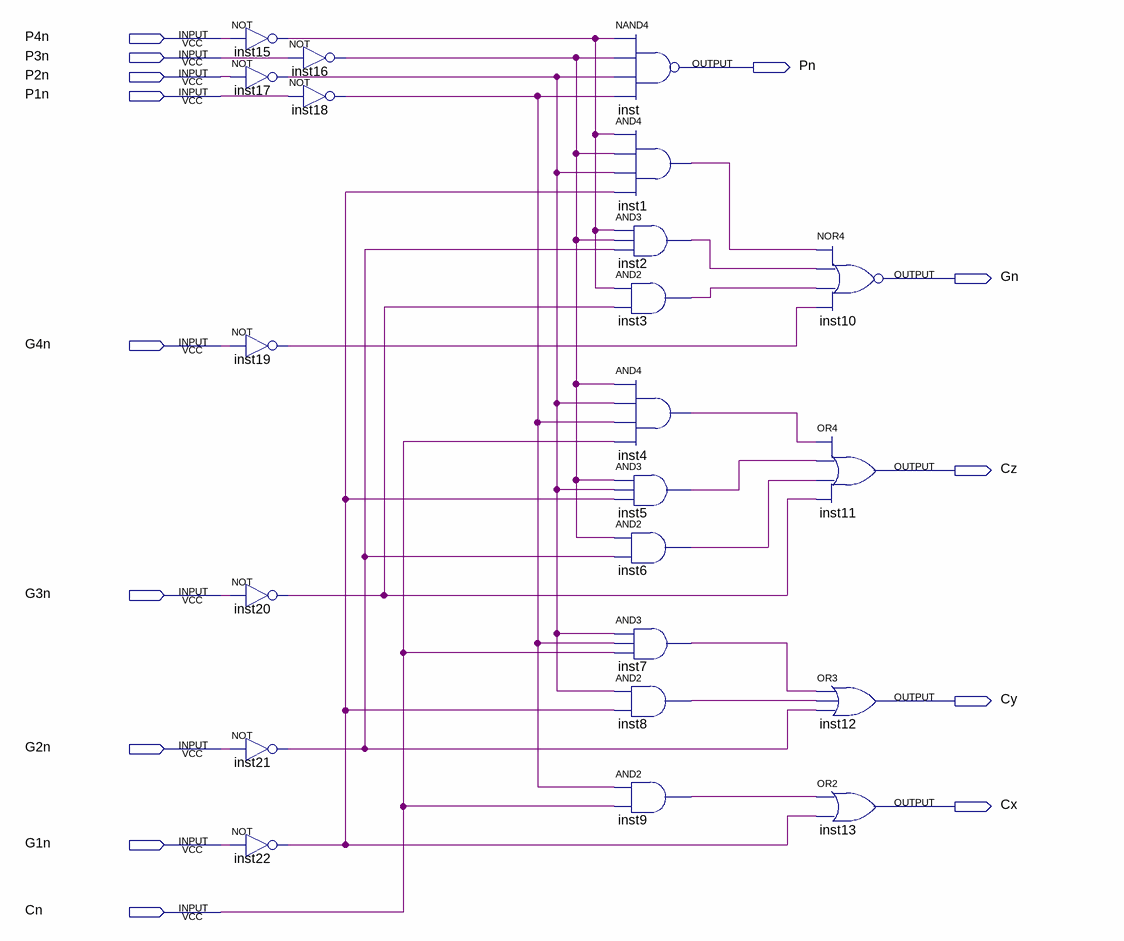
[diagram p0: schematic sheet]
// Quartus schematic ALUIP4.bdf as structural Verilog: 22 symbols, 14 pins
module ALUIP4 (
  input  P4n,
  input  P3n,
  input  P2n,
  input  P1n,
  input  G4n,
  input  G3n,
  input  G2n,
  input  G1n,
  input  Cn,
  output Pn,
  output Gn,
  output Cz,
  output Cy,
  output Cx
);

  wire inst1_out, inst2_out, inst3_out, inst4_out, inst5_out, inst6_out, inst7_out, inst8_out, inst9_out,
       inst15_out, inst16_out, inst17_out, inst18_out, inst19_out, inst20_out, inst21_out, inst22_out;

  not inst15 (inst15_out, P4n);
  not inst16 (inst16_out, P3n);
  not inst17 (inst17_out, P2n);
  not inst18 (inst18_out, P1n);
  not inst19 (inst19_out, G4n);
  not inst20 (inst20_out, G3n);
  not inst21 (inst21_out, G2n);
  not inst22 (inst22_out, G1n);
  nand inst (Pn, inst15_out, inst16_out, inst17_out, inst18_out);
  and inst1 (inst1_out, inst15_out, inst16_out, inst17_out, inst22_out);
  and inst2 (inst2_out, inst15_out, inst16_out, inst21_out);
  and inst3 (inst3_out, inst15_out, inst20_out);
  and inst4 (inst4_out, inst16_out, inst17_out, inst18_out, Cn);
  and inst5 (inst5_out, inst16_out, inst17_out, inst22_out);
  and inst6 (inst6_out, inst16_out, inst21_out);
  and inst7 (inst7_out, inst17_out, inst18_out, Cn);
  and inst8 (inst8_out, inst17_out, inst22_out);
  and inst9 (inst9_out, inst18_out, Cn);
  nor inst10 (Gn, inst1_out, inst2_out, inst3_out, inst19_out);
  or inst11 (Cz, inst4_out, inst5_out, inst6_out, inst20_out);
  or inst12 (Cy, inst7_out, inst8_out, inst21_out);
  or inst13 (Cx, inst9_out, inst22_out);
endmodule
